# Altium schematic sheet Sheet1.SchDoc
size C
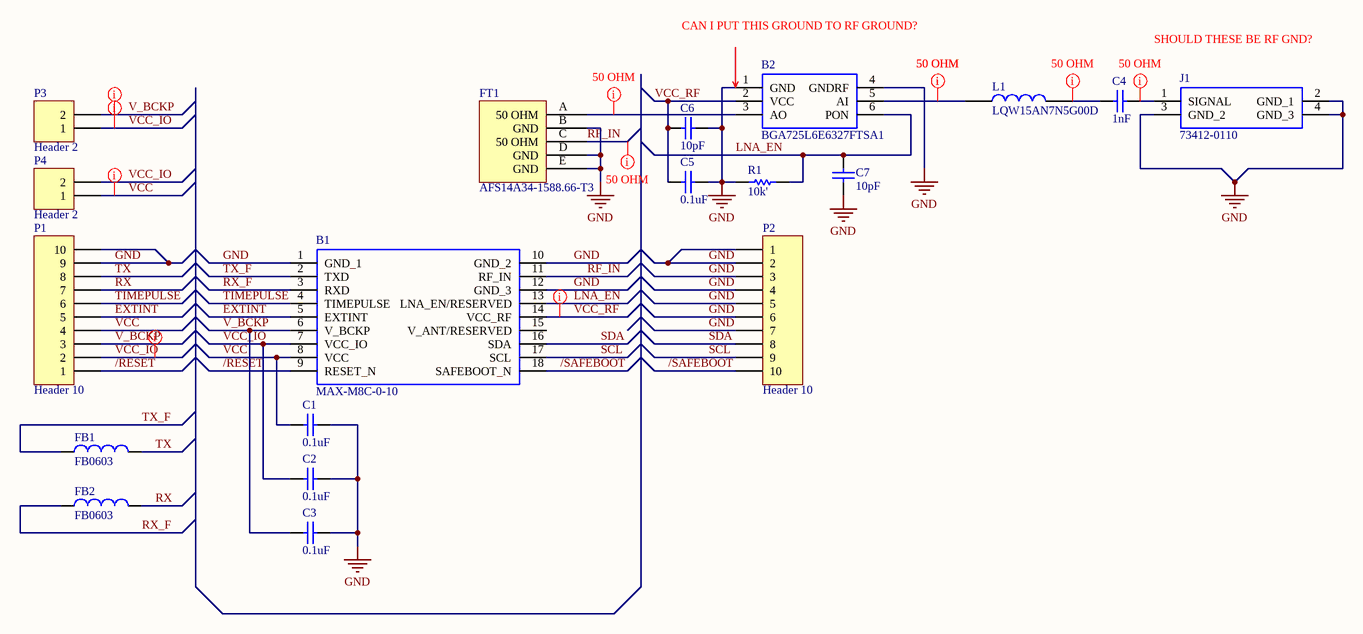
[diagram p0: Sheet1.SchDoc]

## Parts
B1  MAX-M8C-0-10  [MAX-M8]
B2  BGA725L6E6327FTSA1  [BGS12SN6E6327XTSA1]
C1  value 0.1uF  [0603CAP]  (hidden comment: C0603)
C2  value 0.1uF  [0603CAP]  (hidden comment: C0603)
C3  value 0.1uF  [0603CAP]  (hidden comment: C0603)
C4  value 1nF  [0603CAP]  (hidden comment: C0603)
C5  value 0.1uF  [0603CAP]  (hidden comment: C0603)
C6  value 10pF  [0603CAP]  (hidden comment: C0603)
C7  value 10pF  [0603CAP]  (hidden comment: C0603)
FB1  FB0603  [0603CAP]
FB2  FB0603  [0603CAP]
FT1  AFS14A34-1588.66-T3  [AFS14A34-1588.66-T3]
J1  73412-0110  [73412-0110]
L1  LQW15AN7N5G00D  [INDC1005X55N]
P1  Header 10  [HDR1X10]
P2  Header 10  [HDR1X10]
P3  Header 2  [HDR1X2]
P4  Header 2  [HDR1X2]
R1  value 10k'  [0603RES]  (hidden comment: R0603)

## Nets
GND: B1.1(GND_1) B1.10(GND_2) B1.12(GND_3) B2.1(GND) B2.4(GNDRF) C1.2 C2.2 C3.2 C5.2 C6.2 C7.1 FT1.B(GND) FT1.D(GND) FT1.E(GND) J1.2(GND_1) J1.3(GND_2) J1.4(GND_3) P1.9 P1.10 P2.1 P2.2 P2.3 P2.4 P2.5 P2.6 P2.7 R1.1
/RESET: B1.9(RESET_N) P1.1
/SAFEBOOT: B1.18(SAFEBOOT_N) P2.10
EXTINT: B1.5(EXTINT) P1.5
LNA_EN: B1.13(LNA_EN/RESERVED) B2.6(PON) C7.2 R1.2
RF_IN: B1.11(RF_IN) FT1.C(50_OHM)
RX: FB2.2 P1.7
RX_F: B1.3(RXD) FB2.1
SCL: B1.17(SCL) P2.9
SDA: B1.16(SDA) P2.8
TIMEPULSE: B1.4(TIMEPULSE) P1.6
TX: FB1.2 P1.8
TX_F: B1.2(TXD) FB1.1
V_BCKP: B1.6(V_BCKP) C3.1 P1.3 P3.2
VCC: B1.8(VCC) C1.1 P1.4 P4.1
VCC_IO: B1.7(VCC_IO) C2.1 P1.2 P3.1 P4.2
VCC_RF: B1.14(VCC_RF) B2.2(VCC) C5.1 C6.1
NetB2_3: B2.3(AO) FT1.A(50_OHM)
NetB2_5: B2.5(AI) L1.1
NetC4_1: C4.1 L1.2
NetC4_2: C4.2 J1.1(SIGNAL)

Not connected (* = marked no-connect by the designer): B1 15(V_ANT/RESERVED)

## Layout directives
net class 50 OHM: NetB2_3, NetB2_5, NetC4_1, NetC4_2, RF_IN
net class POWER: V_BCKP, VCC, VCC_IO, VCC_RF

## Notes on the sheet
- CAN I PUT THIS GROUND TO RF GROUND?
- SHOULD THESE BE RF GND?

## Library data of the parts
B1 = MAX-M8C-0-10: u-blox M8 concurrent GNSS module; Manufacturer_Name: U-Blox; Manufacturer_Part_Number: MAX-M8C-0-10; RS Part Number: *; RS Price/Stock: *; Mouser Part Number: *; Mouser Price/Stock: *; Datasheet Link: https://www.u-blox.com/sites/default/files/MAX-M8-FW3_DataSheet_%28UBX-15031506%29.pdf
B2 = BGA725L6E6327FTSA1: INFINEON - BGA725L6E6327FTSA1 - RF AMP, 20DB, 1.615GHZ, 3.6V, TSLP-6; Manufacturer_Name: Infineon; Manufacturer_Part_Number: BGA725L6E6327FTSA1; RS Part Number: *; RS Price/Stock: *; Mouser Part Number: 726-BGA725L6E6327FTS; Mouser Price/Stock: https://www.mouser.com/Search/Refine.aspx?Keyword=726-BGA725L6E6327FTS; Datasheet Link: https://www.infineon.com/dgdl/Infineon-BGA725L6-DS-v02_00-en.pdf?fileId=db3a30433784a0400137ef9a4d341f23
C1-C7 = C0603: 0603 Ceramic Chip Capacitor - Standard
FB1 FB2 = FB0603: 0603 Multilayer Ferrite Power Bead; Manufacturer: KOA Speer; Manufacturer P/N: CZP1JFTTD121P; Vendor: Mouser; Vendor P/N: 660-CZP1JFTTD121P; Resistance @ 100MHz: 120; Price: 0.15; ComponentLink1URL: *
FT1 = AFS14A34-1588.66-T3: SAW FILTER; MANUFACTURER: Abracon LLC; MANUFACTURER PN: AFS14A34-1588.66-T3; COMPONENT LINK 1: https://abracon.com/Filters/SAW%20FILTERS/AFS14A34-1588.66-T3.pdf; DIGIKEY PN: 535-13421-1-ND
J1 = 73412-0110: 50 Ohms, MCRF, PCB Vertical Jack Receptacle, SMT, 1.25mm Mounted Height; Manufacturer_Name: Molex; Allied_Number: 70357960; Manufacturer_Part_Number: 73412-0110; RS Part Number: 1676350; RS Price/Stock: http://uk.rs-online.com/web/p/products/1676350; Allied Price/Stock: https://www.alliedelec.com/molex-incorporated-73412-0110/70357960/; Mouser Part Number: 538-73412-0110; Mouser Price/Stock: https://www.mouser.com/Search/Refine.aspx?Keyword=538-73412-0110; Datasheet Link: http://www.molex.com/pdm_docs/sd/734120110_sd.pdf
L1 = LQW15AN7N5G00D: Inductor SMD 0402 7.5nH 570mA Murata LQW15A Series Wire-wound SMD Inductor with a Ferrite Core, 0.0075 uH +/-2% 570mA Idc Q:25; Manufacturer_Name: Murata Electronics; Geometry.Height: 0.55mm; Manufacturer_Part_Number: LQW15AN7N5G00D; RS Part Number: 7926473P; RS Price/Stock: http://uk.rs-online.com/web/p/products/7926473P; Mouser Part Number: 81-LQW15AN7N5G00D; Mouser Price/Stock: https://www.mouser.com/Search/Refine.aspx?Keyword=81-LQW15AN7N5G00D; Datasheet Link: http://uk.rs-online.com/web/p/products/7926473
P1 P2 = Header 10: Header, 10-Pin; LatestRevisionDate: 17-Jul-2002; LatestRevisionNote: Re-released for DXP Platform.; Publisher: Altium Limited
P3 P4 = Header 2: Header, 2-Pin; LatestRevisionDate: 17-Jul-2002; LatestRevisionNote: Re-released for DXP Platform.; Publisher: Altium Limited
R1 = R0603: 0603 Chip Resistor - Standard